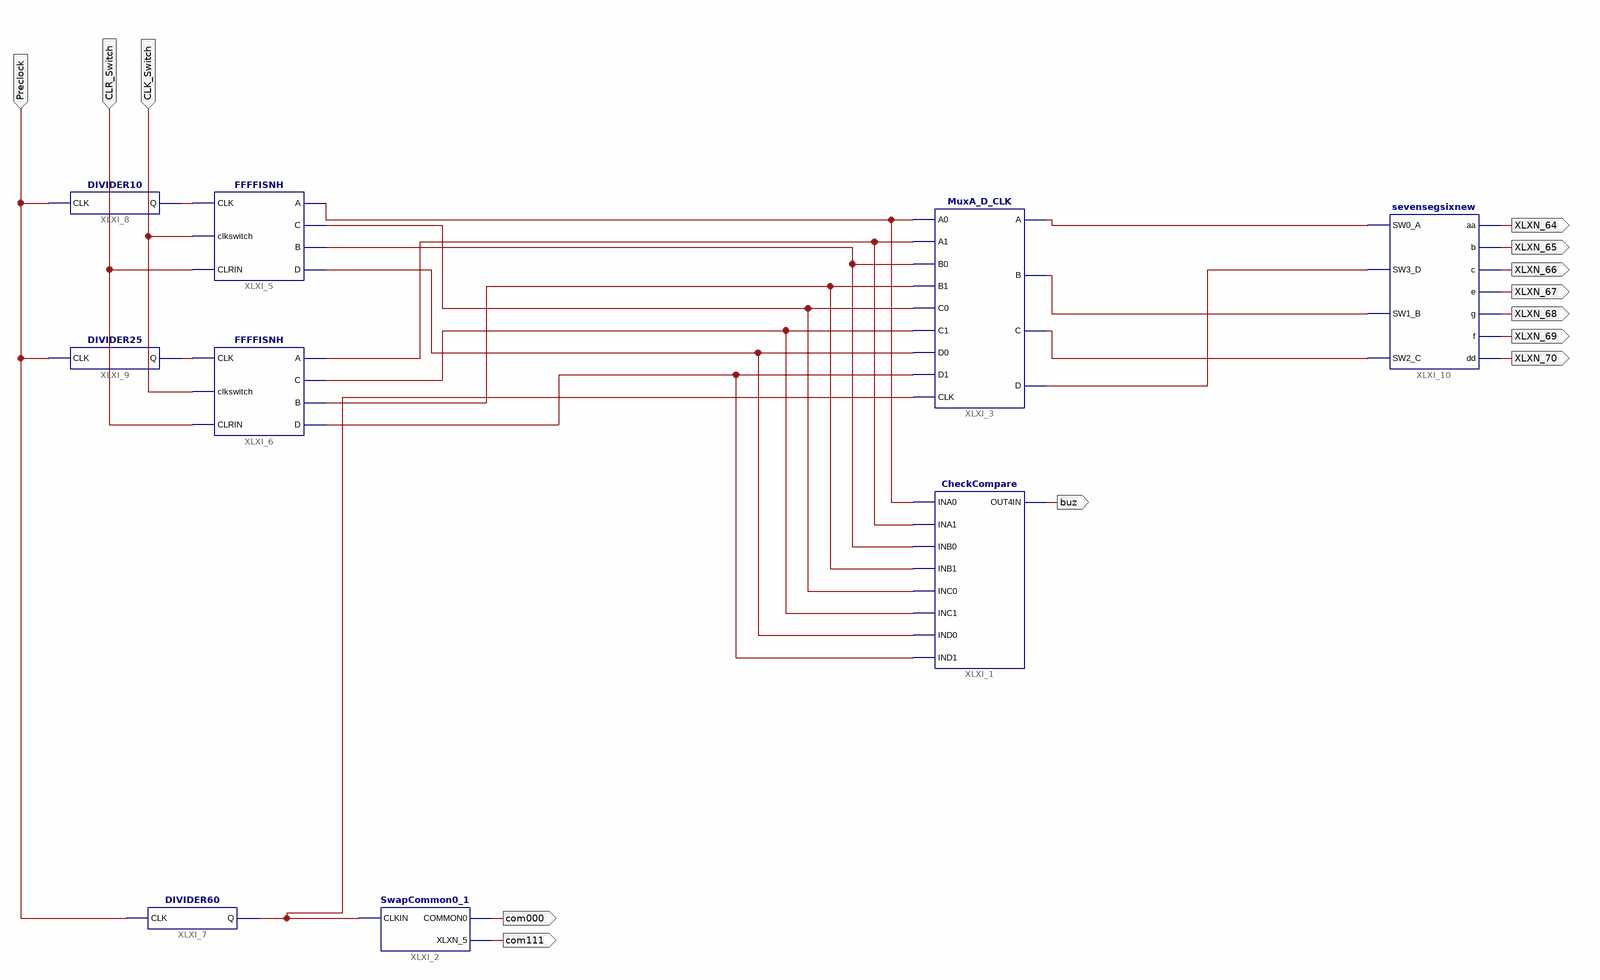
[diagram p0: schematic sheet 1]
// Xilinx ISE schematic Lab6new.sch (spartan6) as structural Verilog: 9 symbols, 13 ports
module Lab6new (
  input  CLR_Switch,
  input  CLK_Switch,
  input  Preclock,
  output buz,
  output com000,
  output com111,
  output XLXN_64,
  output XLXN_65,
  output XLXN_66,
  output XLXN_67,
  output XLXN_68,
  output XLXN_69,
  output XLXN_70
);

  wire XLXN_1, XLXN_2, XLXN_3, XLXN_4, XLXN_18, XLXN_23, XLXN_24, XLXN_25, XLXN_26, XLXN_27, XLXN_28,
       XLXN_29, XLXN_57, XLXN_58, XLXN_62;

  SwapCommon0_1 XLXI_2 (.CLKIN(XLXN_62), .COMMON0(com000), .XLXN_5(com111));
  MuxA_D_CLK XLXI_3 (
    .A0(XLXN_24), .A1(XLXN_25), .B0(XLXN_18), .B1(XLXN_26), .C0(XLXN_27), .C1(XLXN_28), .D0(XLXN_29),
    .D1(XLXN_23), .CLK(XLXN_62), .A(XLXN_1), .B(XLXN_2), .C(XLXN_3), .D(XLXN_4));
  CheckCompare XLXI_1 (
    .INA0(XLXN_24), .INA1(XLXN_25), .INB0(XLXN_18), .INB1(XLXN_26), .INC0(XLXN_27), .INC1(XLXN_28),
    .IND0(XLXN_29), .IND1(XLXN_23), .OUT4IN(buz));
  FFFFISNH XLXI_5 (
    .CLK(XLXN_57), .clkswitch(CLK_Switch), .CLRIN(CLR_Switch), .A(XLXN_24), .C(XLXN_27), .B(XLXN_18),
    .D(XLXN_29));
  FFFFISNH XLXI_6 (
    .CLK(XLXN_58), .clkswitch(CLK_Switch), .CLRIN(CLR_Switch), .A(XLXN_25), .C(XLXN_28), .B(XLXN_26),
    .D(XLXN_23));
  DIVIDER60 XLXI_7 (.CLK(Preclock), .Q(XLXN_62));
  DIVIDER10 XLXI_8 (.CLK(Preclock), .Q(XLXN_57));
  DIVIDER25 XLXI_9 (.CLK(Preclock), .Q(XLXN_58));
  sevensegsixnew XLXI_10 (
    .SW0_A(XLXN_1), .SW3_D(XLXN_4), .SW1_B(XLXN_2), .SW2_C(XLXN_3), .aa(XLXN_64), .b(XLXN_65), .c(XLXN_66),
    .e(XLXN_67), .g(XLXN_68), .f(XLXN_69), .dd(XLXN_70));
endmodule
